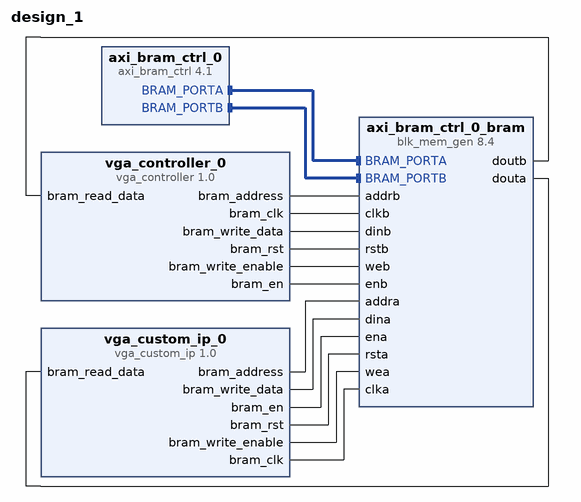
[diagram p0: block diagram of the top level]
# Vivado block design design_1, xc7a100tcsg324-1, Vivado 2018.3
create_bd_design design_1

create_bd_cell -type ip -vlnv xilinx.com:ip:axi_bram_ctrl:4.1 axi_bram_ctrl_0
create_bd_cell -type ip -vlnv xilinx.com:user:vga_custom_ip:1.0 vga_custom_ip_0
create_bd_cell -type ip -vlnv xilinx.com:ip:blk_mem_gen:8.4 axi_bram_ctrl_0_bram
set_property -dict {CONFIG.Memory_Type True_Dual_Port_RAM} [get_bd_cells axi_bram_ctrl_0_bram]
create_bd_cell -type ip -vlnv xilinx.com:user:vga_controller:1.0 vga_controller_0

# ---- connections ----

connect_bd_intf_net [get_bd_intf_pins axi_bram_ctrl_0_bram/BRAM_PORTA] [get_bd_intf_pins axi_bram_ctrl_0/BRAM_PORTA]
connect_bd_intf_net [get_bd_intf_pins axi_bram_ctrl_0_bram/BRAM_PORTB] [get_bd_intf_pins axi_bram_ctrl_0/BRAM_PORTB]
connect_bd_net [get_bd_pins vga_controller_0/bram_address] [get_bd_pins axi_bram_ctrl_0_bram/addrb]
connect_bd_net [get_bd_pins vga_controller_0/bram_clk] [get_bd_pins axi_bram_ctrl_0_bram/clkb]
connect_bd_net [get_bd_pins vga_controller_0/bram_write_data] [get_bd_pins axi_bram_ctrl_0_bram/dinb]
connect_bd_net [get_bd_pins axi_bram_ctrl_0_bram/doutb] [get_bd_pins vga_controller_0/bram_read_data]
connect_bd_net [get_bd_pins vga_controller_0/bram_rst] [get_bd_pins axi_bram_ctrl_0_bram/rstb]
connect_bd_net [get_bd_pins vga_controller_0/bram_write_enable] [get_bd_pins axi_bram_ctrl_0_bram/web]
connect_bd_net [get_bd_pins vga_custom_ip_0/bram_address] [get_bd_pins axi_bram_ctrl_0_bram/addra]
connect_bd_net [get_bd_pins vga_custom_ip_0/bram_write_data] [get_bd_pins axi_bram_ctrl_0_bram/dina]
connect_bd_net [get_bd_pins axi_bram_ctrl_0_bram/douta] [get_bd_pins vga_custom_ip_0/bram_read_data]
connect_bd_net [get_bd_pins vga_custom_ip_0/bram_en] [get_bd_pins axi_bram_ctrl_0_bram/ena]
connect_bd_net [get_bd_pins vga_custom_ip_0/bram_rst] [get_bd_pins axi_bram_ctrl_0_bram/rsta]
connect_bd_net [get_bd_pins vga_custom_ip_0/bram_write_enable] [get_bd_pins axi_bram_ctrl_0_bram/wea]
connect_bd_net [get_bd_pins vga_custom_ip_0/bram_clk] [get_bd_pins axi_bram_ctrl_0_bram/clka]
connect_bd_net [get_bd_pins vga_controller_0/bram_en] [get_bd_pins axi_bram_ctrl_0_bram/enb]

validate_bd_design
save_bd_design
